# Altium schematic sheet 2017-04-15_13-23-051.schdoc
size 288 x 149 mm; SheetNumber: 1; SheetTotal: 1
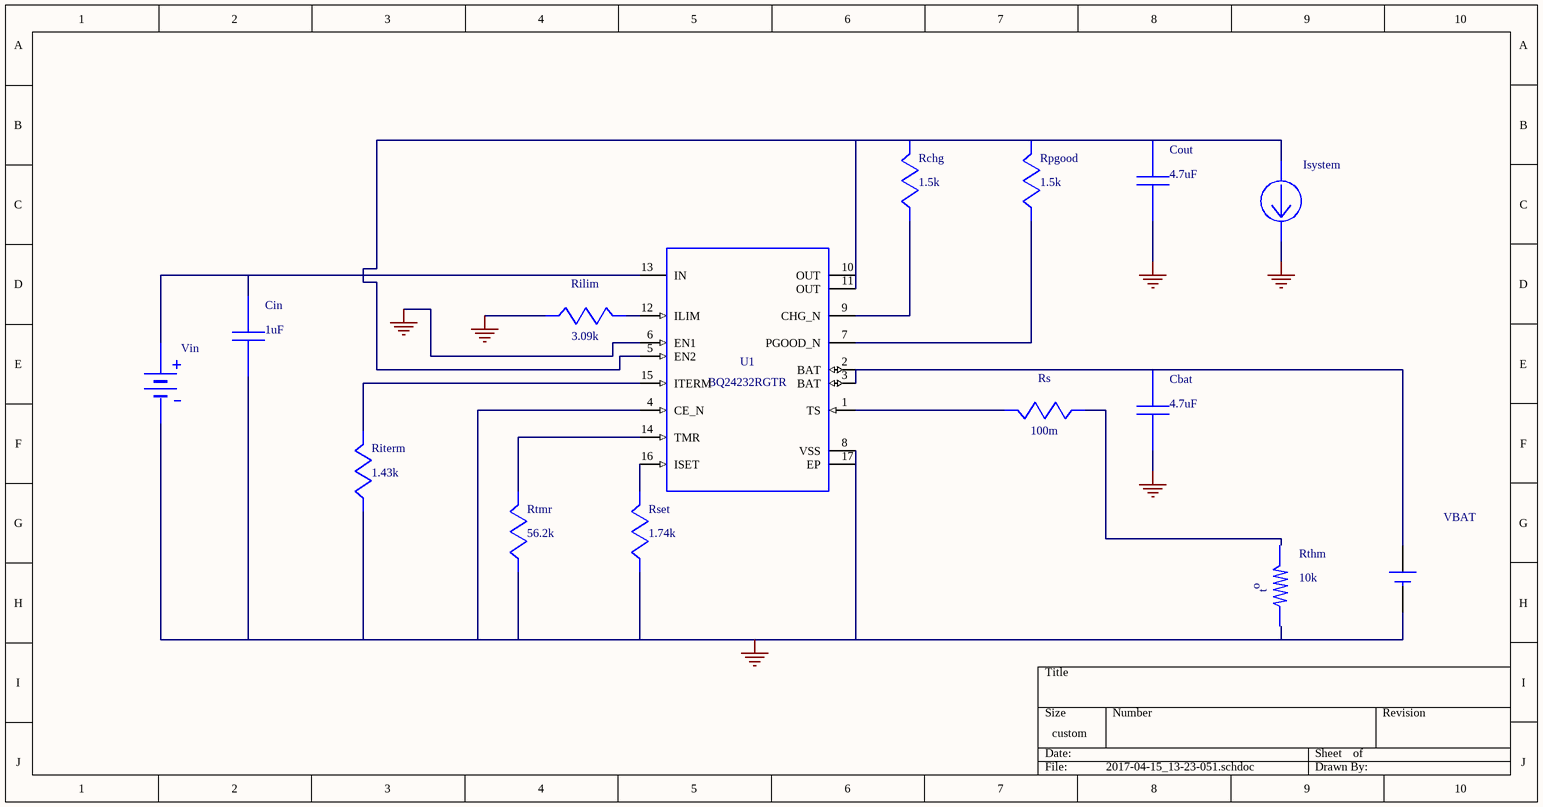
[diagram p0: 2017-04-15_13-23-051.schdoc]

## Parts
Cbat  value 4.7uF  (hidden comment: GRM21BR61E475KA12L)
Cin  value 1uF  (hidden comment: GRM188R61A105KA61D)
Cout  value 4.7uF  (hidden comment: GRM21BR61E475MA12L)
Isystem  WB_CURRENT_LOAD  (value not drawn)
Rchg  value 1.5k  (hidden comment: CRCW04021K50FKED)
Rilim  value 3.09k  (hidden comment: CRCW04023K09FKED)
Riterm  value 1.43k  (hidden comment: CRCW04021K43FKED)
Rpgood  value 1.5k  (hidden comment: CRCW04021K50FKED)
Rs  value 100m  (hidden comment: ERJ-3RSFR10V)
Rset  value 1.74k  (hidden comment: CRCW04021K74FKED)
Rthm  value 10k  (hidden comment: NCP15XH103E03RC)
Rtmr  value 56.2k  (hidden comment: CRCW040256K2FKED)
U1  BQ24232RGTR
VBAT  WB_BATTERY_SINGLE_USFP  (value not drawn)
Vin  WB_BATTERY  (value not drawn)

## Nets
0: Cbat.2 Cin.2 Cout.2 Isystem.2(-) Rilim.2 Riterm.2 Rset.2 Rtmr.2 U1.4(CE_N) U1.6(EN1) U1.8(VSS) U1.17(EP) VBAT.2(-) Vin.2(-)
NetCbat_1: Cbat.1 U1.2(BAT) U1.3(BAT) VBAT.1(+)
NetCin_1: Cin.1 U1.13(IN) Vin.1(+)
NetCout_1: Cout.1 Isystem.1(+) Rchg.1 Rpgood.1 U1.5(EN2) U1.10(OUT) U1.11(OUT)
NetRchg_2: Rchg.2 U1.9(CHG_N)
NetRilim_1: Rilim.1 U1.12(ILIM)
NetRiterm_1: Riterm.1 U1.15(ITERM)
NetRpgood_2: Rpgood.2 U1.7(PGOOD_N)
NetRs_1: Rs.1 U1.1(TS)
NetRset_1: Rset.1 U1.16(ISET)
NetRtmr_1: Rtmr.1 U1.14(TMR)

Not connected (* = marked no-connect by the designer): Rs 2; Rthm 1 2

## Notes on the sheet
- (near Rthm) o
- (near Rthm) t

## Library data of the parts
Cbat = GRM21BR61E475KA12L: GRM21BR61E475KA1; Manufacturer Name: MuRata; PackageReference: GRM21BR61E475KA12L; Manufacturer Part Number: GRM21BR61E475KA12L
Cin = GRM188R61A105KA61D: GRM188R61A105KA6; Manufacturer Name: MuRata; PackageReference: GRM188R61A105KA61D; Manufacturer Part Number: GRM188R61A105KA61D
Cout = GRM21BR61E475MA12L: GRM21BR61E475MA1; Manufacturer Name: MuRata; PackageReference: GRM21BR61E475MA12L; Manufacturer Part Number: GRM21BR61E475MA12L
Rchg Rpgood = CRCW04021K50FKED: Manufacturer Name: Vishay-Dale; PackageReference: CRCW04021K50FKED; Manufacturer Part Number: CRCW04021K50FKED
Rilim = CRCW04023K09FKED: Manufacturer Name: Vishay-Dale; PackageReference: CRCW04023K09FKED; Manufacturer Part Number: CRCW04023K09FKED
Riterm = CRCW04021K43FKED: Manufacturer Name: Vishay-Dale; PackageReference: CRCW04021K43FKED; Manufacturer Part Number: CRCW04021K43FKED
Rs = ERJ-3RSFR10V: Manufacturer Name: Panasonic; PackageReference: ERJ-3RSFR10V; Manufacturer Part Number: ERJ-3RSFR10V
Rset = CRCW04021K74FKED: Manufacturer Name: Vishay-Dale; PackageReference: CRCW04021K74FKED; Manufacturer Part Number: CRCW04021K74FKED
Rthm = NCP15XH103E03RC: Manufacturer Name: MuRata; PackageReference: NCP15XH103E03RC; Manufacturer Part Number: NCP15XH103E03RC
Rtmr = CRCW040256K2FKED: Manufacturer Name: Vishay-Dale; PackageReference: CRCW040256K2FKED; Manufacturer Part Number: CRCW040256K2FKED
U1 = BQ24232RGTR: Manufacturer Name: Texas Instruments; PackageReference: BQ24232RGTR; Manufacturer Part Number: BQ24232RGTR; Value: N/A
VBAT = WB_BATTERY_SINGLE_USFP: WB_BATTERY_SINGL; PackageReference: WB_BATTERY_SINGLE_USFP; Manufacturer Part Number: WB_BATTERY_SINGLE_USFP; Manufacturer Name: WB_BATTERY_SINGLE_USFP; Value: N/A
Isystem = WB_CURRENT_LOAD: PackageReference: WB_CURRENT_LOAD; Manufacturer Part Number: WB_CURRENT_LOAD; Manufacturer Name: WB_CURRENT_LOAD; Value: N/A
Vin = WB_BATTERY: PackageReference: WB_BATTERY; Manufacturer Part Number: WB_BATTERY; Manufacturer Name: WB_BATTERY; Value: N/A